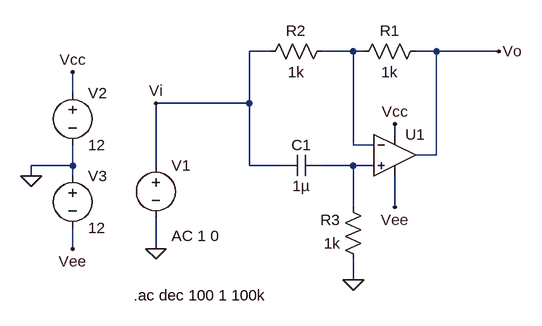
[diagram p0: schematic pasa_todo.asc]
pasa_todo.asc, the LTspice schematic file:
Version 4
SHEET 1 880 680
WIRE 16 48 -16 48
WIRE 144 48 96 48
WIRE 160 48 144 48
WIRE 272 48 240 48
WIRE 368 48 272 48
WIRE -288 112 -288 80
WIRE -16 128 -16 48
WIRE -16 128 -160 128
WIRE 208 176 208 160
WIRE 144 192 144 48
WIRE 176 192 144 192
WIRE 272 208 272 48
WIRE 272 208 240 208
WIRE -288 224 -288 192
WIRE -288 224 -352 224
WIRE -160 224 -160 128
WIRE -16 224 -16 128
WIRE 32 224 -16 224
WIRE 144 224 96 224
WIRE 176 224 144 224
WIRE -352 240 -352 224
WIRE -288 240 -288 224
WIRE 144 288 144 224
WIRE 208 288 208 240
WIRE -288 352 -288 320
WIRE -160 352 -160 304
WIRE 144 400 144 368
FLAG 144 400 0
FLAG -160 352 0
FLAG 368 48 Vo
FLAG -160 128 Vi
FLAG -288 80 Vcc
FLAG 208 288 Vee
FLAG 208 160 Vcc
FLAG -352 240 0
FLAG -288 352 Vee
SYMBOL res 256 32 R90
WINDOW 0 0 56 VBottom 2
WINDOW 3 32 56 VTop 2
SYMATTR InstName R1
SYMATTR Value 1k
SYMBOL res 112 32 R90
WINDOW 0 0 56 VBottom 2
WINDOW 3 32 56 VTop 2
SYMATTR InstName R2
SYMATTR Value 1k
SYMBOL cap 32 240 R270
WINDOW 0 32 32 VTop 2
WINDOW 3 0 32 VBottom 2
SYMATTR InstName C1
SYMATTR Value 1µ
SYMBOL res 160 384 R180
WINDOW 0 36 76 Left 2
WINDOW 3 36 40 Left 2
SYMATTR InstName R3
SYMATTR Value 1k
SYMBOL voltage -160 208 R0
WINDOW 123 24 124 Left 2
WINDOW 39 0 0 Left 0
SYMATTR InstName V1
SYMATTR Value ""
SYMATTR Value2 AC 1 0
SYMBOL OpAmps\\UniversalOpamp2 208 208 R0
SYMATTR InstName U1
SYMBOL voltage -288 96 R0
SYMATTR InstName V2
SYMATTR Value 12
SYMBOL voltage -288 224 R0
SYMATTR InstName V3
SYMATTR Value 12
TEXT -194 424 Left 2 !.ac dec 100 1 100k

The netlist it stands for:
* pasa_todo.asc
R1 Vo N001 1k
R2 N001 Vi 1k
C1 Vi N002 1µ
R3 0 N002 1k
V1 Vi 0 AC 1 0
XU1 N002 N001 Vcc Vee Vo level.2 Avol=1Meg GBW=10Meg Slew=10Meg ilimit=25m rail=0 Vos=0 phimargin=45 en=0 enk=0 in=0 ink=0 Rin=500Meg  ; pins IN+ IN- V+ V- OUT
V2 Vcc 0 12
V3 0 Vee 12
.ac dec 100 1 100k
.lib UniversalOpamps2.sub
.backanno
.end

* Results of the author's LTspice run, read from the files saved beside the schematic
* Operating Point, zero values left out:
*   V(vcc) = 12 V
*   V(vee) = -12 V
*   I(V3) = -1.199 mA
*   I(V2) = -1.199 mA
*   Ix(u1:3) = 1.199 mA
*   Ix(u1:4) = -1.199 mA
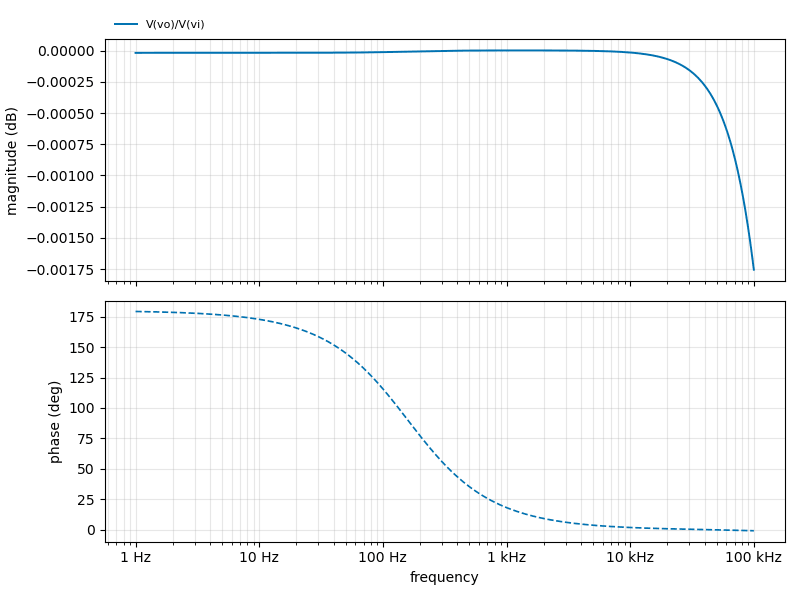
[diagram p1: AC Analysis of pasa_todo.asc, plotted from the saved traces]
* AC Analysis, 1 run:
*   V(vo)/V(vi): -0.00 dB at 1 Hz, -0.00 dB at 100 kHz, peak 0.00 dB at 1.288 kHz